# EAGLE schematic roboboard2_backup (EAGLE 6.3)
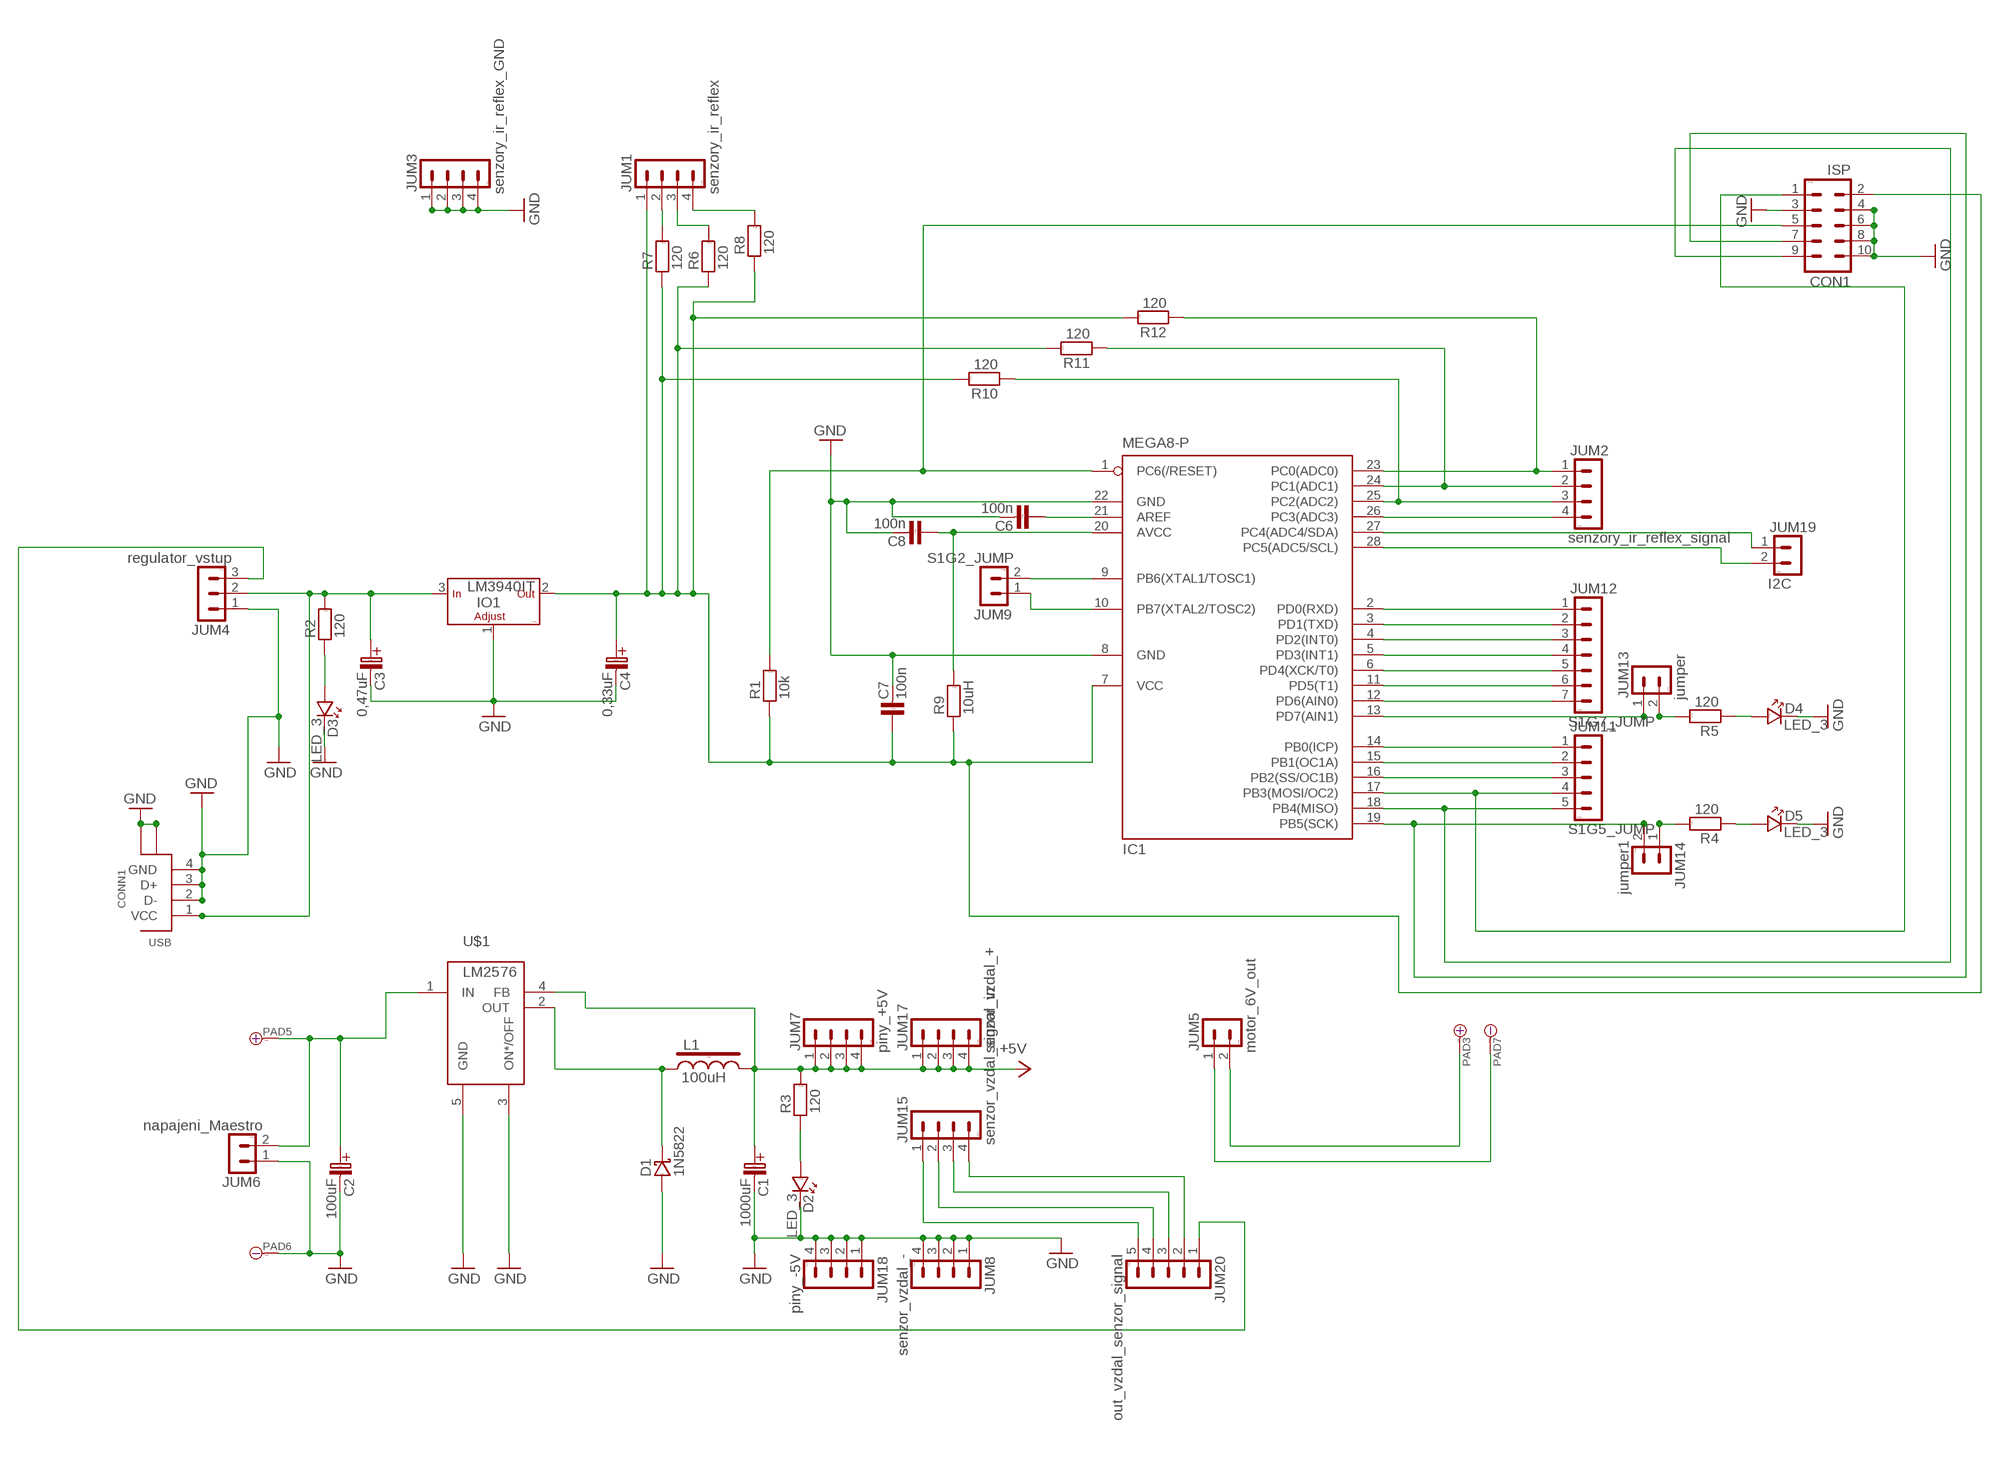
[diagram p0: schematic, sheet 1]

## Parts
C1  1000uF  C-ELEKTROLYT_5  [C-EL_5]
C2  100uF  C-ELEKTROLYT_5  [C-EL_5]
C3  0,47uF  C-ELEKTROLYT_5  [C-EL_5]
C4  0,33uF  C-ELEKTROLYT_3,5  [C-EL_3,5]
C6  100n  C-KERAMIK_2,5  [C-2,5]
C7  100n  C-KERAMIK_2,5  [C-2,5]
C8  100n  C-KERAMIK_2,5  [C-2,5]
CON1  ISP  MLW10_90°  [MLW10A]
CONN1  USB  [PN61729]
D1  1N5822  MBR760  [TO-220AC]
D2  LED_3  [LED_3]
D3  LED_3  [LED_3]
D4  LED_3  [LED_3]
D5  LED_3  [LED_3]
IC1  MEGA8-P  [DIL28-3]
IO1  LM3940IT  LM317T_LEZ  [TO-220]
JUM1  senzory_ir_reflex  S1G4_JUMP  [S1G4_JUM]
JUM2  senzory_ir_reflex_signal  S1G4_JUMP  [S1G4_JUM]
JUM3  senzory_ir_reflex_GND  S1G4_JUMP  [S1G4_JUM]
JUM4  regulator_vstup  S1G3_JUMP  [S1G3_JUM]
JUM5  motor_6V_out  S1G2_JUMP  [S1G2_JUM]
JUM6  napajeni_Maestro  S1G2_JUMP  [S1G2_JUM]
JUM7  piny_+5V  S1G4_JUMP  [S1G4_JUM]
JUM8  senzor_vzdal_-  S1G4_JUMP  [S1G4_JUM]
JUM9  S1G2_JUMP  [S1G2_JUM]
JUM11  S1G5_JUMP  [S1G5_JUM]
JUM12  S1G7_JUMP  [S1G7_JUM]
JUM13  jumper  S1G2_JUMP  [S1G2_JUM]
JUM14  jumper1  S1G2_JUMP  [S1G2_JUM]
JUM15  senzor_vzdal_signal_in  S1G4_JUMP  [S1G4_JUM]
JUM17  senzor_vzdal_+  S1G4_JUMP  [S1G4_JUM]
JUM18  piny_-5V  S1G4_JUMP  [S1G4_JUM]
JUM19  I2C  S1G2_JUMP  [S1G2_JUM]
JUM20  out_vzdal_senzor_signal  S1G5_JUMP  [S1G5_JUM]
L1  100uH  FED_2200  [FED_2200]
PAD3  motor_6V_in  PAD_1+  [PAD_1]
PAD5  11,1V  PAD_1+  [PAD_1]
PAD6  PAD_1-  [PAD_1]
PAD7  6V_motor  PAD_1-  [PAD_1]
R1  10k  R_10  [R-10]
R2  120  R_10  [R-10]
R3  120  R_10  [R-10]
R4  120  R_10  [R-10]
R5  120  R_10  [R-10]
R6  120  R_10  [R-10]
R7  120  R_10  [R-10]
R8  120  R_10  [R-10]
R9  10uH  R_10  [R-10]
R10  120  R_10  [R-10]
R11  120  R_10  [R-10]
R12  120  R_10  [R-10]
U$1  LM2576  [LM2576]

## Nets
+5V: C1.C+(C_EL+) JUM7.1 JUM7.2 JUM7.3 JUM7.4 JUM17.1 JUM17.2 JUM17.3 JUM17.4 L1.2 R3.2 U$1.4(FB)
GND: C1.C-(C_EL-) C2.C-(C_EL-) C3.C-(C_EL-) C4.C-(C_EL-) C6.2 C7.2 C8.2 CON1.3 CON1.4 CON1.6 CON1.8 CON1.10 CONN1.2(D-) CONN1.3(D+) CONN1.4(GND) CONN1.P$1 CONN1.P$2 D1.A D2.K D3.K D4.K D5.K IC1.8(GND) IC1.22(GND) IO1.1(ADJ) JUM3.1 JUM3.2 JUM3.3 JUM3.4 JUM4.1 JUM6.1 JUM8.1 JUM8.2 JUM8.3 JUM8.4 JUM18.1 JUM18.2 JUM18.3 JUM18.4 PAD6.1(-) U$1.3(ON*/OFF) U$1.5(GND)
N$1: D1.K L1.1 U$1.2(OUT)
N$2: C6.1 IC1.21(AREF)
N$3: C8.1 IC1.20(AVCC) R9.2
N$4: CON1.5 IC1.1(PC6(/RESET)) R1.2
N$5: IC1.24(PC1(ADC1)) JUM2.2 R11.1
N$6: IC1.25(PC2(ADC2)) JUM2.3 R10.1
N$7: IC1.23(PC0(ADC0)) JUM2.1 R12.1
N$8: IC1.26(PC3(ADC3)) JUM2.4
N$9: IC1.27(PC4(ADC4/SDA)) JUM19.1
N$10: IC1.28(PC5(ADC5/SCL)) JUM19.2
N$11: IC1.2(PD0(RXD)) JUM12.1
N$12: IC1.3(PD1(TXD)) JUM12.2
N$13: IC1.4(PD2(INT0)) JUM12.3
N$14: IC1.5(PD3(INT1)) JUM12.4
N$15: IC1.6(PD4(XCK/T0)) JUM12.5
N$16: IC1.11(PD5(T1)) JUM12.6
N$17: IC1.12(PD6(AIN0)) JUM12.7
N$18: IC1.13(PD7(AIN1)) JUM13.1
N$19: IC1.14(PB0(ICP)) JUM11.1
N$20: IC1.15(PB1(OC1A)) JUM11.2
N$21: CON1.1 IC1.17(PB3(MOSI/OC2)) JUM11.4
N$22: IC1.16(PB2(SS/OC1B)) JUM11.3
N$23: CON1.9 IC1.18(PB4(MISO)) JUM11.5
N$24: CON1.7 IC1.19(PB5(SCK)) JUM14.2
N$25: JUM5.1 PAD7.1(-)
N$26: IC1.9(PB6(XTAL1/TOSC1)) JUM9.2
N$28: D4.A R5.1
N$29: JUM4.3 JUM20.1
N$30: D3.A R2.1
N$31: D2.A R3.1
N$32: C2.C+(C_EL+) JUM6.2 PAD5.1(+) U$1.1(IN)
N$33: JUM5.2 PAD3.1(+)
N$34: IC1.10(PB7(XTAL2/TOSC2)) JUM9.1
N$35: D5.A R4.1
N$36: JUM13.2 R5.2
N$37: JUM1.2 R7.2
N$38: JUM1.3 R6.2
N$39: JUM1.4 R8.2
N$40: JUM14.1 R4.2
N$41: JUM15.1 JUM20.5
N$42: JUM15.2 JUM20.4
N$43: JUM15.3 JUM20.3
N$44: JUM15.4 JUM20.2
N$48: C4.C+(C_EL+) C7.1 CON1.2 IC1.7(VCC) IO1.2(OUT) JUM1.1 R1.1 R6.1 R7.1 R8.1 R9.1 R10.2 R11.2 R12.2
VCC: C3.C+(C_EL+) CONN1.1(VCC) IO1.3(IN) JUM4.2 R2.2

## Library data of the parts
C1-C4 = #PaJa_22:C-ELEKTROLYT: Kondenzator - elektrolyticky
C6-C8 = #PaJa_22:C-KERAMIK: Kondenzator - keramicky
CON1 = #PaJa_22:MLW10: Konektory MLW - vidlice - 10x
CONN1 = dodolcd:USB: USB connector
D1 = #PaJa_22:MBR760: Schottkyho dioda - 15A, 60V
D2-D5 = #PaJa_22:LED: LED - jednobarevna
IC1 = atmel:MEGA8-P: MICROCONTROLLER 8 Kbytes FLASH, 1 kbytes SRAM, 512 bytes EEPROM, USART, 4-channel 10 bit ADC, 2-channel 8 bit ADC Pin compatible with Atmega48, ATMega88, ATMega168 Source: avr.lbr; OC_FARNELL: unknown; OC_NEWARK: unknown
IO1 = #PaJa_22:LM317T: Stabilizator - s nastavitelnym napetim - 1,5A
JUM1-JUM3 JUM7 JUM8 JUM15 JUM17 JUM18 = #PaJa_22:S1G4_JUMP: Radove konektory - koliky - 4x
JUM4 = #PaJa_22:S1G3_JUMP: Radove konektory - koliky - 3x
JUM5 JUM6 JUM9 JUM13 JUM14 JUM19 = #PaJa_22:S1G2_JUMP: Radove konektory - koliky - 2x
JUM11 JUM20 = #PaJa_22:S1G5_JUMP: Radove konektory - koliky - 5x
JUM12 = #PaJa_22:S1G7_JUMP: Radove konektory - koliky - 7x
L1 = #PaJa_22:FED_2200: Tlumivka FED - 2,2 mH (pro stmivace) 2.3A, 340mOhm, max 500W (více na GES)
PAD3 PAD5 = #PaJa_22:PAD_1+: Pajeci bod - 2,54 mm prumer, + kladny
PAD6 PAD7 = #PaJa_22:PAD_1-: Pajeci bod - 2,54 mm prumer, - zaporny
R1-R12 = #PaJa_22:R: Rezistor
U$1 = LM2576:LM2576: LM2576 - 5V switching regulator